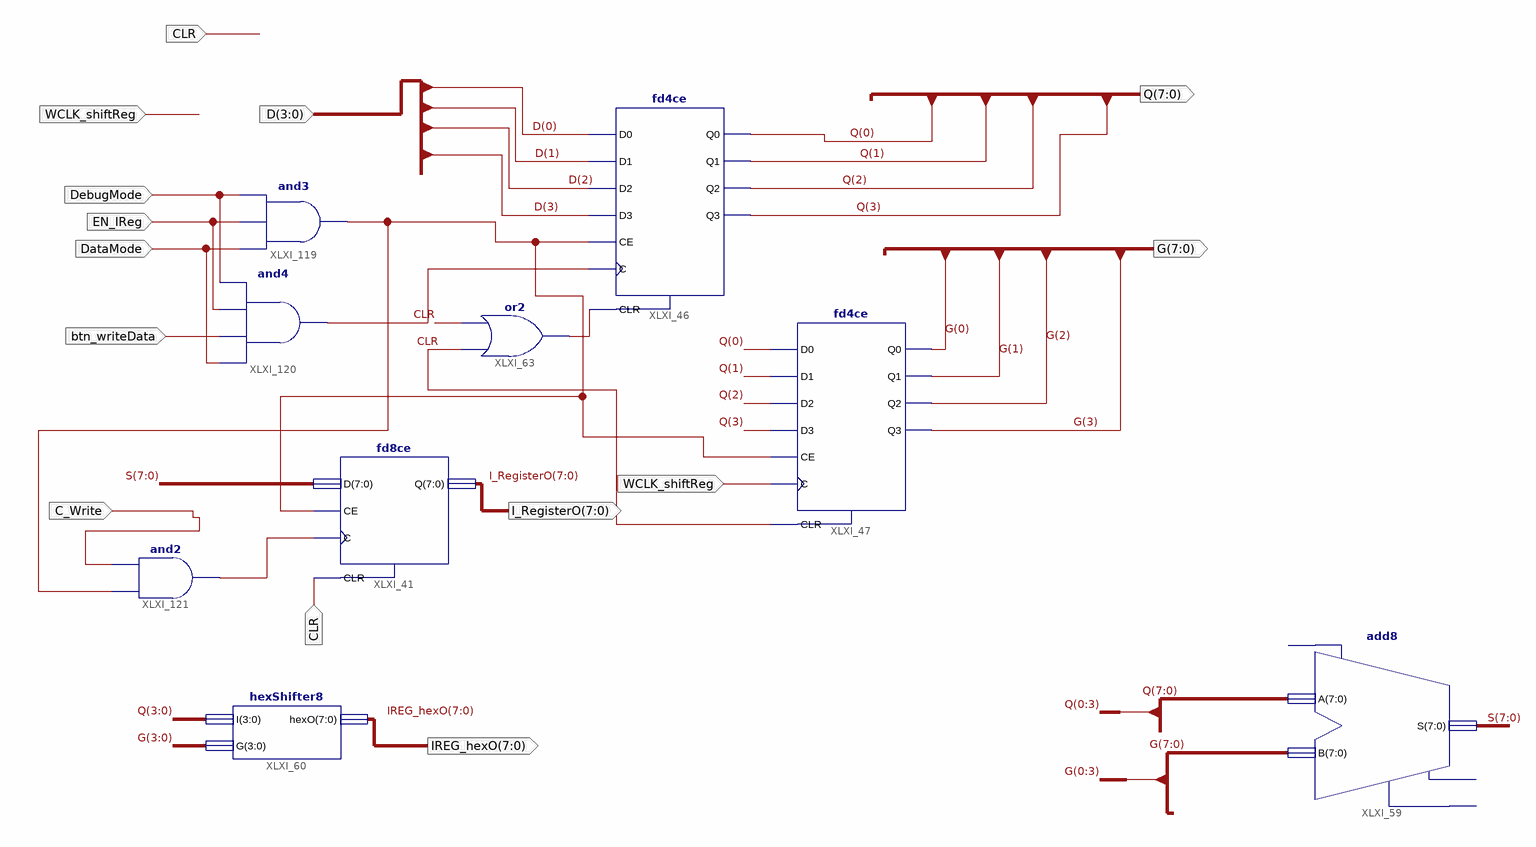
[diagram p0: schematic sheet 1]
// Xilinx ISE schematic I_Register.sch (spartan3e) as structural Verilog: 9 symbols, 12 ports
module I_Register (
  input  [3:0] D,
  input  CLR,
  input  WCLK_shiftReg,
  input  EN_IReg,
  input  DebugMode,
  input  DataMode,
  input  btn_writeData,
  input  C_Write,
  output [7:0] Q,
  output [7:0] G,
  output [7:0] I_RegisterO,
  output [7:0] IREG_hexO
);

  wire XLXN_313, XLXN_351, XLXN_354, XLXN_355;
  wire [7:0] S;

  fd4ce XLXI_46 (
    .C(XLXN_351), .CE(XLXN_354), .CLR(XLXN_313), .D0(D[0]), .D1(D[1]), .D2(D[2]), .D3(D[3]), .Q0(Q[0]),
    .Q1(Q[1]), .Q2(Q[2]), .Q3(Q[3]));
  fd4ce XLXI_47 (
    .C(WCLK_shiftReg), .CE(XLXN_354), .CLR(CLR), .D0(Q[0]), .D1(Q[1]), .D2(Q[2]), .D3(Q[3]), .Q0(G[0]),
    .Q1(G[1]), .Q2(G[2]), .Q3(G[3]));
  add8 XLXI_59 (.A(Q), .B(G), .S(S));  // open: CI, CO, OFL
  or XLXI_63 (XLXN_313, CLR, CLR);
  fd8ce XLXI_41 (.C(XLXN_355), .CE(XLXN_354), .CLR(CLR), .D(S), .Q(I_RegisterO));
  hexShifter8 XLXI_60 (.I(Q[3:0]), .G(G[3:0]), .hexO(IREG_hexO));
  and XLXI_119 (XLXN_354, DataMode, EN_IReg, DebugMode);
  and XLXI_120 (XLXN_351, DataMode, btn_writeData, EN_IReg, DebugMode);
  and XLXI_121 (XLXN_355, XLXN_354, C_Write);
endmodule
